# EAGLE schematic schematic (EAGLE 9.6.2)
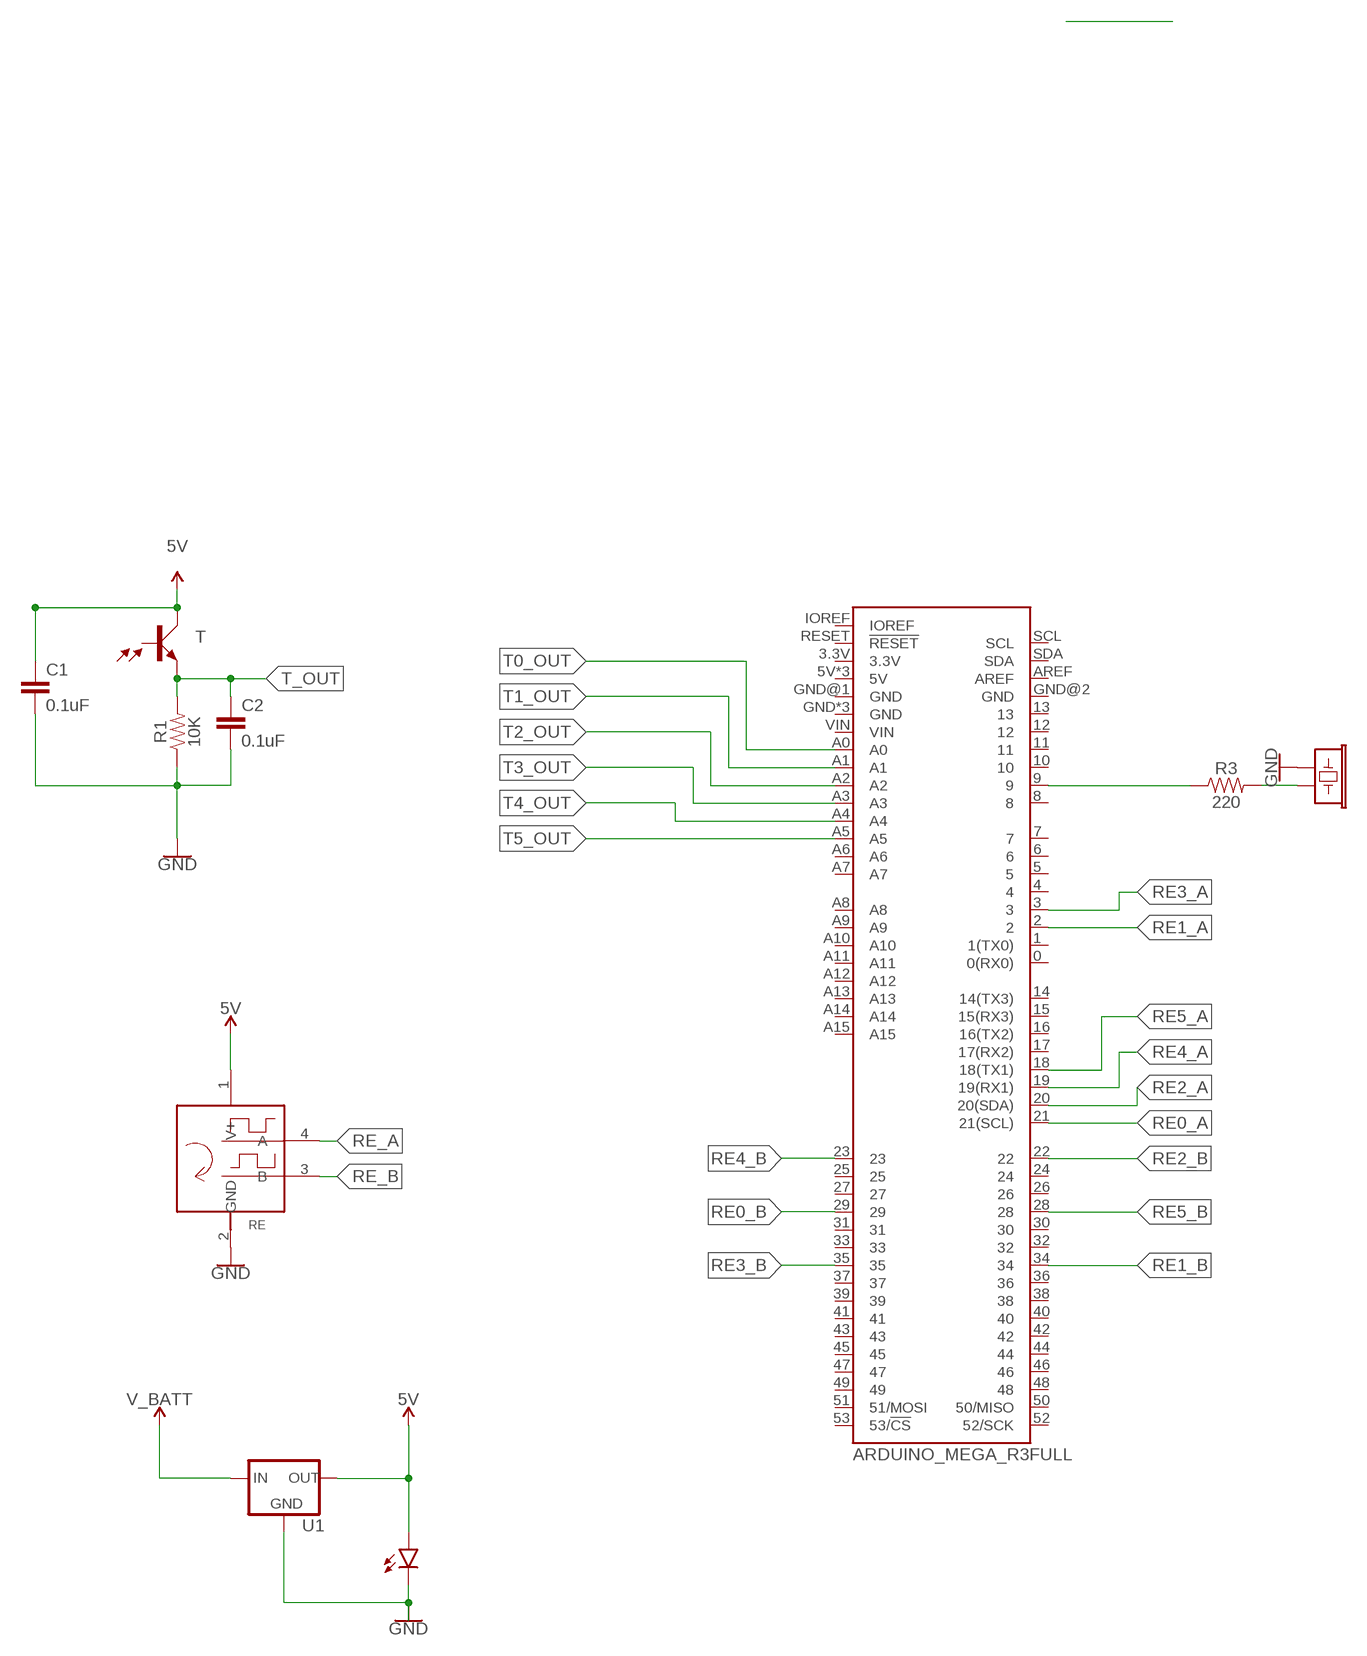
[diagram p0: schematic, sheet 1]

## Parts
B2  ARDUINO_MEGA_R3FULL  [ARDUINO_MEGA_NO_SILK]
BUZZER  BUZZER-PTH_KIT  [BUZZER-12MM-KIT]
C1  0.1uF  0.1UF-0402-6.3V-10%-X7R  [0402]
C2  0.1uF  0.1UF-0402-6.3V-10%-X7R  [0402]
LASER  LAP4-BOTTOM  [P47F-BOTTOM]
R1  10K  10KOHM-0402-1/10W-0.1%  [0402-TIGHT]
R3  220  220OHM-0402-TIGHT-1/16W-1%  [0402-TIGHT]
RE  62P16-H0  [62P]
T  SFH303  [SFH303]
U1  R-78E5.0-1.0  [DC-DC_CONVERTER_78XX]

## Nets
5V: C1.1 LASER.A RE.1(V+) T.2(C) U1.VOUT(OUT)
GND: BUZZER.+ C1.2 C2.2 LASER.C R1.1 RE.2(GND) U1.GND
N$2: BUZZER.- R3.2
N$3: B2.9 R3.1
RE0_A: B2.21(21(SCL))
RE0_B: B2.29
RE1_A: B2.2
RE1_B: B2.34
RE2_A: B2.20(20(SDA))
RE2_B: B2.22
RE3_A: B2.3
RE3_B: B2.35
RE4_A: B2.19(19(RX1))
RE4_B: B2.23
RE5_A: B2.18(18(TX1))
RE5_B: B2.28
RE_A: RE.4(A)
RE_B: RE.3(B)
T0_OUT: B2.A0
T1_OUT: B2.A1
T2_OUT: B2.A2
T3_OUT: B2.A3
T4_OUT: B2.A4
T5_OUT: B2.A5
T_OUT: C2.1 R1.2 T.1(E)
V_BATT: U1.VIN(IN)
Unconnected: B2.0(0(RX0)) B2.1(1(TX0)) B2.3.3V B2.4 B2.5 B2.5V B2.5V@1(5V) B2.5V@2(5V) B2.6 B2.7 B2.8 B2.10 B2.11 B2.12 B2.13 B2.14(14(TX3)) B2.15(15(RX3)) B2.16(16(TX2)) B2.17(17(RX2)) B2.24 B2.25 B2.26 B2.27 B2.30 B2.31 B2.32 B2.33 B2.36 B2.37 B2.38 B2.39 B2.40 B2.41 B2.42 B2.43 B2.44 B2.45 B2.46 B2.47 B2.48 B2.49 B2.50(50/MISO) B2.51(51/MOSI) B2.52(52/SCK) B2.53(53/!CS) B2.A6 B2.A7 B2.A8 B2.A9 B2.A10 B2.A11 B2.A12 B2.A13 B2.A14 B2.A15 B2.AREF B2.GND B2.GND@1(GND) B2.GND@2(GND) B2.GND@3(GND) B2.GND@4(GND) B2.IOREF B2.RESET(!RESET) B2.SCL B2.SDA B2.VIN T.3(B)

## Library data of the parts
B2 = SparkFun-Boards:ARDUINO_MEGA_R3: Arduino Mega R3 ATmega2560 R3 compatible footprint. SparkFun Products: Arduino Mega 2560 R3 <https://www.sparkfun.com/products/11061>
BUZZER = SparkFun-Electromechanical:BUZZER: Buzzer Small round buzzers that operate around the audible 2kHz range. You can use these as speakers to create simple music or user interfaces. Variant Overview: PTH - Mini Speaker - PC Mount 12mm 2.048kHz <https://www.sparkfun.com/products/7950> PTH_KIT - Mini Speaker - PC Mount 12mm 2.048kHz <https://www.sparkfun.com/products/7950> KIT simplifies soldering by adding stop mask to one side of the pads. PTH_NO_SILK - Mini Speaker - PC Mount 12mm 2.048kHz <https://www.sparkfun.com/products/7950> No silkscreen indicator of buzzer outline. PTH_KIT_NO_SILK - Mini Speaker - PC Mount 12mm 2.048kHz <https://www.sparkfun.com/products/7950> KIT package w/o silkscreen SMD - Buzzer Audio Magnetic (CCV-084B16) SMD buzzer used on, e.g. the LilyPad Buzzer <https://www.sparkfun.com/products/8463> and RFID USB Reader <https://www.sparkfun.com/products/9963>. SMD_KIT - Buzzer Audio Magnetic (CCV-084B16) SMD Buzzer with elongated pins to make soldering easier. Used on the SparkFun Simon Says - Surface Mount Soldering Kit <https://www.sparkfun.com/products/10935>. SMD-SQUARE - Buzzer Audio Magnetic (COMP-15701) SMT square buzzer with one chamfered corner.; PROD_ID: COMP-08253; SF_SKU: COM-07950
C1 C2 = SparkFun-Capacitors:0.1UF: 0.1µF ceramic capacitors A capacitor is a passive two-terminal electrical component used to store electrical energy temporarily in an electric field.; PROD_ID: CAP-14993
LASER = led:*P4: PointLED® Enhanced Thinfilm LED TOP & BOTTOM mount LS P47F, LR P47F, LA P47F, LY P47F, LT P4SG, LB P4SG, LW P4SG Source: http://catalog.osram-os.com .. LA_LR_LS_LY_P47F_Pb_free.pdf
R1 = SparkFun-Resistors:10KOHM: 10kΩ resistor A resistor is a passive two-terminal electrical component that implements electrical resistance as a circuit element. Resistors act to reduce current flow, and, at the same time, act to lower voltage levels within circuits. - Wikipedia; PROD_ID: RES-16147
R3 = SparkFun-Resistors:220OHM: 220Ω resistor A resistor is a passive two-terminal electrical component that implements electrical resistance as a circuit element. Resistors act to reduce current flow, and, at the same time, act to lower voltage levels within circuits. - Wikipedia; PROD_ID: RES-15269
RE = rotary-encoder:62P*0
T = opto-trans-siemens:SFH303: Silicium NPN Phototransistor Source: Siemens; OC_FARNELL: unknown; OC_NEWARK: unknown
U1 = SparkFun-IC-Power:R-78E5.0-1.0: Recom Power 5V 1A DC/DC Converter The Recom R-78E5.0-X.X is a compact DC/DC converter module that is a pin for pin drop-in replacement for the LM7805 linear voltage regulator. Specifications: Input Range: 7-28V Output Voltage: 5V Output Current: 1A Max Efficiency: 91% Datasheet <https://www.recom-power.com/pdf/Innoline/R-78Exx-1.0.pdf>; PROD_ID: COM-13655